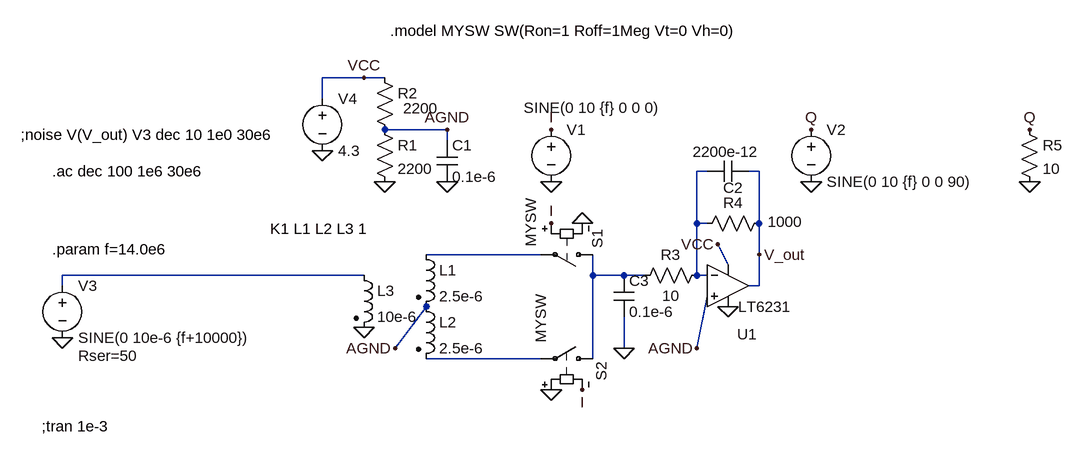
[diagram p0: schematic Draft1.asc]
Draft1.asc, the LTspice schematic file:
Version 4
SHEET 1 880 680
WIRE -272 -224 -336 -224
WIRE -240 -224 -272 -224
WIRE -336 -192 -336 -224
WIRE -144 -144 -240 -144
WIRE -144 -128 -144 -144
WIRE 256 -80 240 -80
WIRE 336 -80 320 -80
WIRE 240 0 240 -80
WIRE 256 0 240 0
WIRE 336 0 336 -80
WIRE 0 48 -176 48
WIRE 336 48 336 0
WIRE 288 64 272 32
WIRE -272 80 -736 80
WIRE 80 80 80 48
WIRE 128 80 80 80
WIRE 160 80 128 80
WIRE 240 80 240 0
WIRE 256 80 240 80
WIRE -736 96 -736 80
WIRE 336 96 336 48
WIRE 336 96 320 96
WIRE -224 192 -176 128
WIRE 128 192 128 144
WIRE 240 192 256 112
WIRE 0 208 -176 208
WIRE 80 208 80 80
FLAG -736 176 0
FLAG -272 160 0
FLAG -336 -112 0
FLAG -240 -64 0
FLAG -144 -64 0
FLAG 16 -64 0
FLAG 64 0 0
FLAG 16 256 0
FLAG 416 -64 0
FLAG -144 -144 AGND
FLAG -224 192 AGND
FLAG 240 192 AGND
FLAG 16 -144 I
FLAG 16 0 I
FLAG 416 -144 Q
FLAG -272 -224 VCC
FLAG 272 32 VCC
FLAG 288 128 0
FLAG 64 256 I
FLAG 128 192 0
FLAG 336 48 V_out
FLAG 752 -64 0
FLAG 752 -144 Q
SYMBOL Opamps\\LT6231 288 96 R0
WINDOW 0 14 75 Left 2
SYMATTR InstName U1
SYMBOL sw 96 48 R90
WINDOW 0 -39 9 Left 2
WINDOW 3 -86 111 Left 2
SYMATTR InstName S1
SYMATTR Value MYSW
SYMBOL sw 96 208 M270
WINDOW 0 -34 3 Left 2
SYMATTR InstName S2
SYMATTR Value MYSW
SYMBOL voltage 16 -160 R0
WINDOW 123 0 0 Left 0
WINDOW 39 0 0 Left 0
WINDOW 3 -42 -18 Left 2
SYMATTR Value SINE(0 10 {f} 0 0 0)
SYMATTR InstName V1
SYMBOL voltage 416 -160 R0
WINDOW 123 0 0 Left 0
WINDOW 39 0 0 Left 0
SYMATTR InstName V2
SYMATTR Value SINE(0 10 {f} 0 0 90)
SYMBOL voltage -736 80 R0
WINDOW 123 0 0 Left 0
WINDOW 39 24 124 Left 2
SYMATTR SpiceLine Rser=50
SYMATTR InstName V3
SYMATTR Value SINE(0 10e-6 {f+10000})
SYMBOL ind2 -192 32 R0
SYMATTR InstName L1
SYMATTR Value 2.5e-6
SYMATTR Type ind
SYMBOL ind2 -192 112 R0
SYMATTR InstName L2
SYMATTR Value 2.5e-6
SYMATTR Type ind
SYMBOL ind2 -288 64 R0
SYMATTR InstName L3
SYMATTR Value 10e-6
SYMATTR Type ind
SYMBOL res -256 -160 R0
SYMATTR InstName R1
SYMATTR Value 2200
SYMBOL res -256 -240 R0
WINDOW 3 44 63 Left 2
SYMATTR Value 2200
SYMATTR InstName R2
SYMBOL cap -160 -128 R0
SYMATTR InstName C1
SYMATTR Value 0.1e-6
SYMBOL voltage -336 -208 R0
WINDOW 123 0 0 Left 0
WINDOW 39 0 0 Left 0
SYMATTR InstName V4
SYMATTR Value 4.3
SYMBOL res 256 64 R90
WINDOW 0 0 56 VBottom 2
WINDOW 3 32 56 VTop 2
SYMATTR InstName R3
SYMATTR Value 10
SYMBOL res 352 -16 R90
WINDOW 0 0 56 VBottom 2
WINDOW 3 -2 -24 VTop 2
SYMATTR InstName R4
SYMATTR Value 1000
SYMBOL cap 320 -96 R90
WINDOW 0 57 24 VBottom 2
WINDOW 3 -30 35 VTop 2
SYMATTR InstName C2
SYMATTR Value 2200e-12
SYMBOL cap 112 80 R0
SYMATTR InstName C3
SYMATTR Value 0.1e-6
SYMBOL res 736 -160 R0
SYMATTR InstName R5
SYMATTR Value 10
TEXT -768 312 Left 2 !;tran 1e-3
TEXT -232 -296 Left 2 !.model MYSW SW(Ron=1 Roff=1Meg Vt=0 Vh=0)
TEXT -416 8 Left 2 !K1 L1 L2 L3 1
TEXT -752 40 Left 2 !.param f=14.0e6
TEXT -800 -136 Left 2 !;noise V(V_out) V3 dec 10 1e0 30e6
TEXT -752 -80 Left 2 !.ac dec 100 1e6 30e6

The netlist it stands for:
* Draft1.asc
XU1 AGND N001 V_out VCC 0 LT6231  ; pins In+ In- OUT V+ V-
S1 N004 N002 I 0 MYSW
S2 N004 N005 0 I MYSW
V1 I 0 SINE(0 10 {f} 0 0 0)
V2 Q 0 SINE(0 10 {f} 0 0 90)
V3 N003 0 SINE(0 10e-6 {f+10000}) Rser=50
L1 N002 AGND 2.5e-6
L2 AGND N005 2.5e-6
L3 N003 0 10e-6
R1 AGND 0 2200
R2 VCC AGND 2200
C1 AGND 0 0.1e-6
V4 VCC 0 4.3
R3 N001 N004 10
R4 V_out N001 1000
C2 V_out N001 2200e-12
C3 N004 0 0.1e-6
R5 Q 0 10
;tran 1e-3
.model MYSW SW(Ron=1 Roff=1Meg Vt=0 Vh=0)
K1 L1 L2 L3 1
.param f=14.0e6
;noise V(V_out) V3 dec 10 1e0 30e6
.ac dec 100 1e6 30e6
.lib LTC2.lib
.backanno
.end